# Altium project Custom Phone.PrjPcb (part 1 of 4)
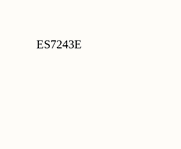
[diagram p0: CM5 + IO.SchDoc, top left]
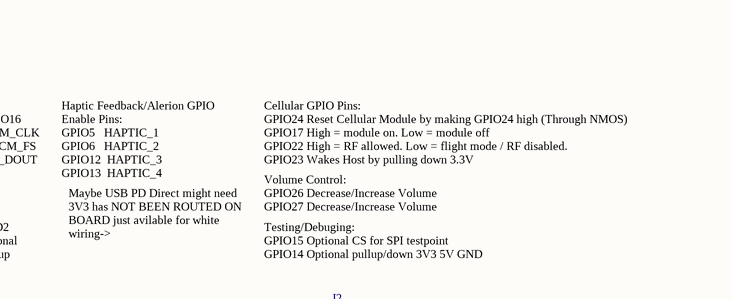
[diagram p1: CM5 + IO.SchDoc, top right]
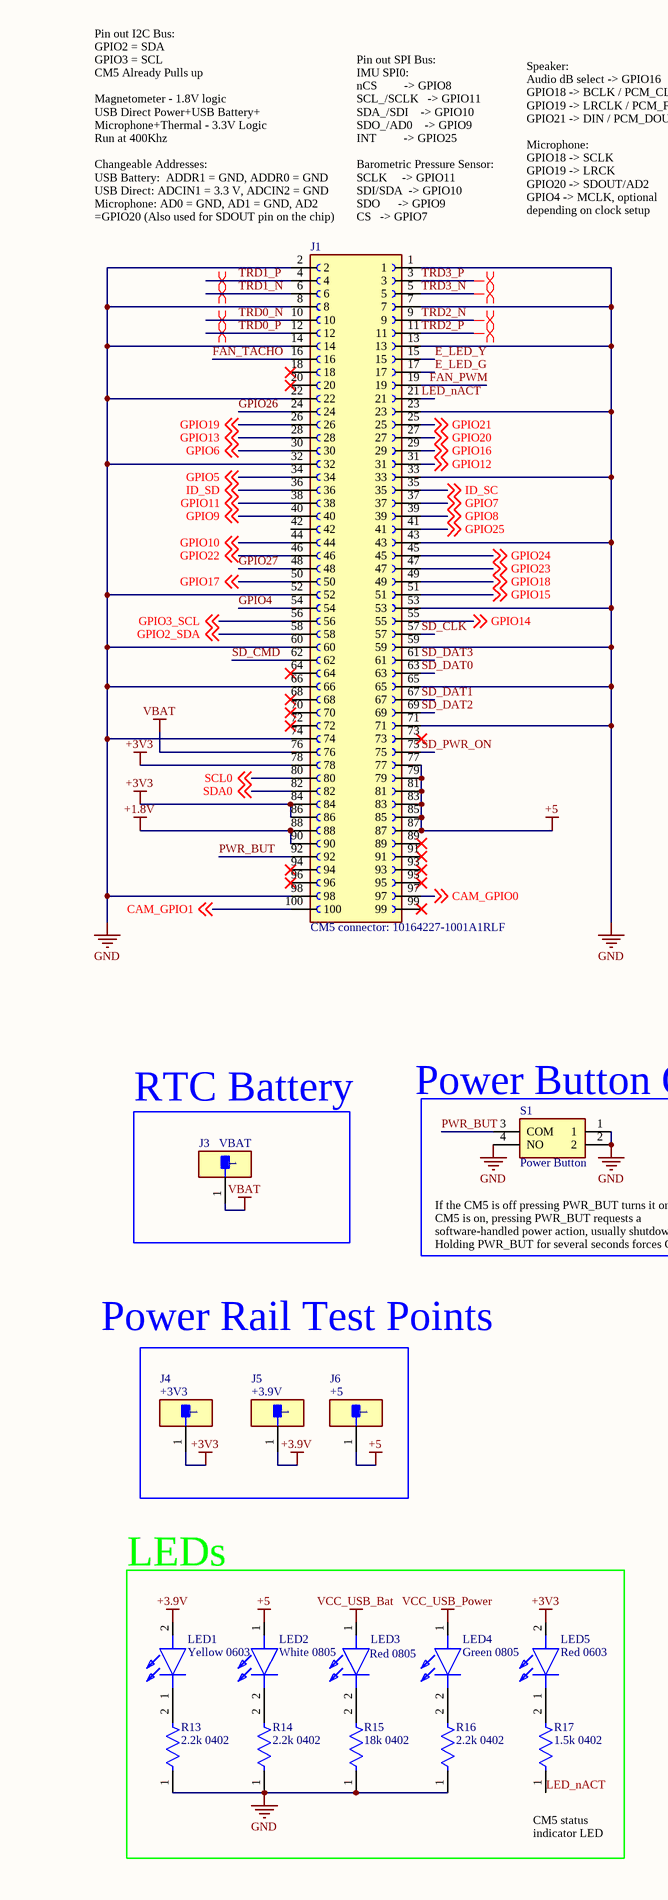
[diagram p2: CM5 + IO.SchDoc, bottom left]
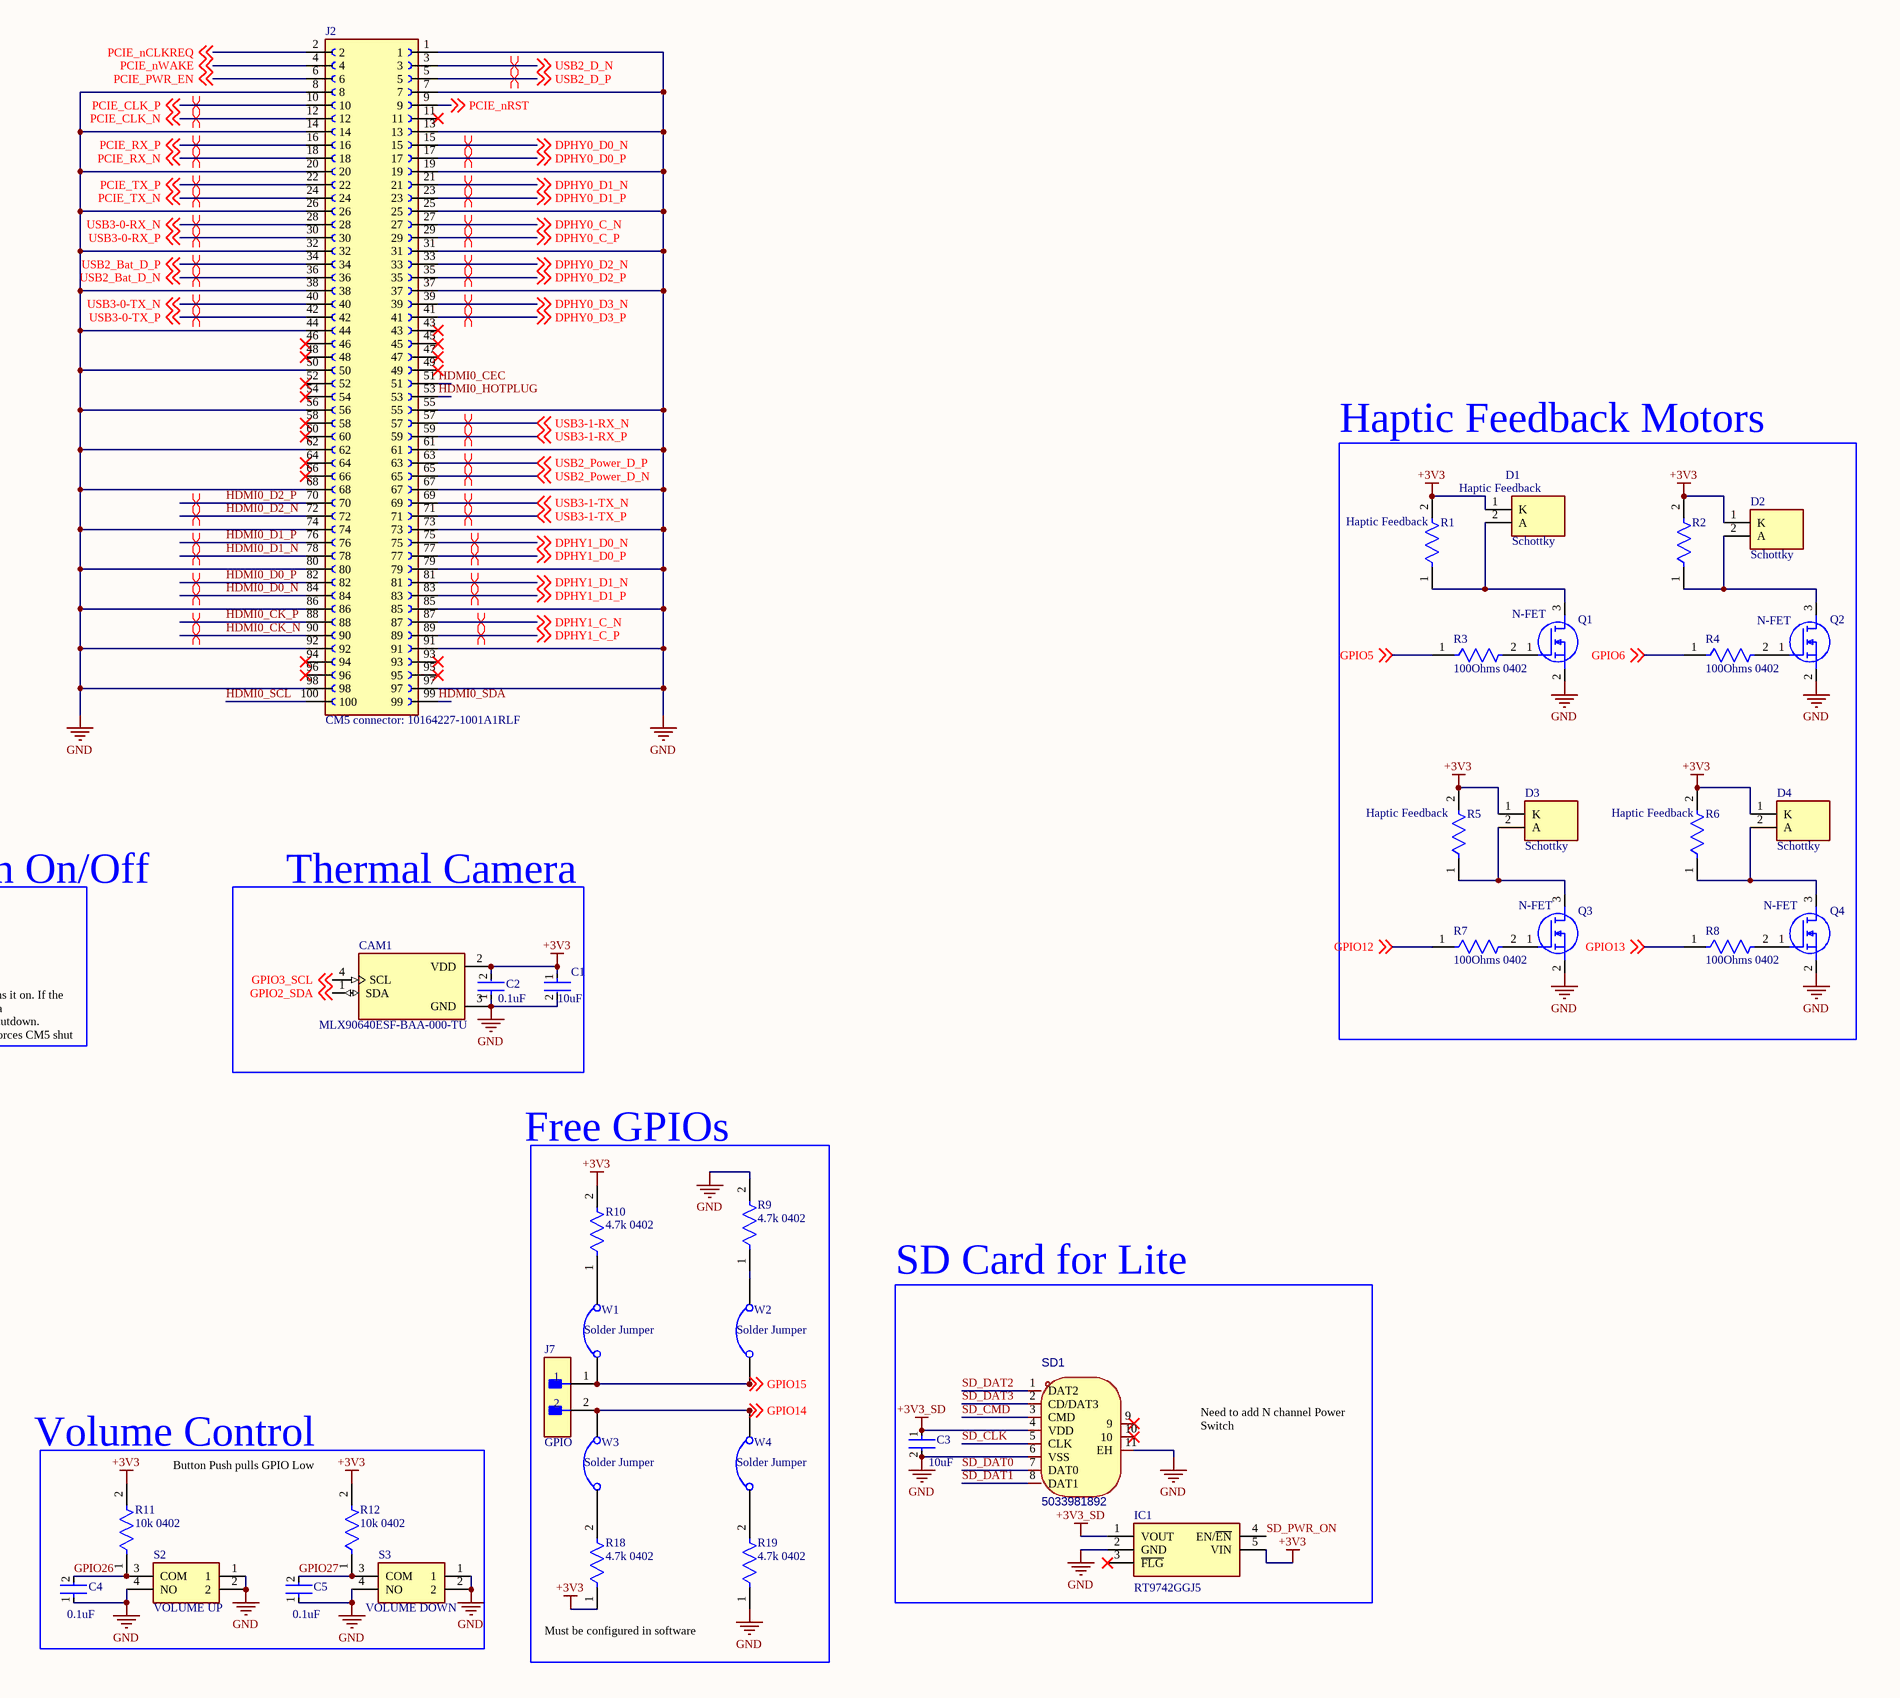
[diagram p3: CM5 + IO.SchDoc, bottom right]
9 sheets, 376 parts. Net scope: global (net labels, ports and power ports of the same name join across sheets).
Board file: Phone Full PCB.PcbDoc
Sheets:
  CM5 + IO.SchDoc
  High-Speed Interfaces.SchDoc
  Power.SchDoc
  Battery Management and Charging.SchDoc
  USBC.SchDoc
  Cellular.SchDoc
  Audio.SchDoc
  Sensors.SchDoc
  Camera + Display.SchDoc

## Sheet CM5 + IO.SchDoc
size C; SheetNumber: 1; SheetTotal: 8

### Parts
C1  10uF  [FP-CC0603-DC-MFG]
C2  0.1uF  [FP-C0402-BB-MFG]
C3  10uF  [FP-CC0603-DC-MFG]
C4  0.1uF  [FP-C0402-BB-MFG]
C5  0.1uF  [FP-C0402-BB-MFG]
CAM1  MLX90640ESF-BAA-000-TU  [TO292P930H600-4]
D1  Schottky  [SOD2513X120N]
D2  Schottky  [SOD2513X120N]
D3  Schottky  [SOD2513X120N]
D4  Schottky  [SOD2513X120N]
IC1  RT9742GGJ5  [SOT94P280X100-5N]
J1  CM5 connector: 10164227-1001A1RLF  [Correct AMPHENOL_10164227-1001A1RLF]
J2  CM5 connector: 10164227-1001A1RLF  [Correct AMPHENOL_10164227-1001A1RLF]
J3  VBAT  [FP-TSW-101-07-L-S-MFG]
J4  +3V3  [FP-5015-MFG]
J5  +3.9V  [FP-5015-MFG]
J6  +5  [FP-5015-MFG]
J7  GPIO  [FP-TSW-102-07-F-S-MFG]
LED1  Yellow 0603  [LEDC1608X70N]
LED2  White 0805  [KT0805G]
LED3  Red 0805  [KT0805G]
LED4  Green 0805  [KT0805G]
LED5  Red 0603  [LEDC1608X70N]
Q1  N-FET  [SOT95P280X125-3N]
Q2  N-FET  [SOT95P280X125-3N]
Q3  N-FET  [SOT95P280X125-3N]
Q4  N-FET  [SOT95P280X125-3N]
R1  Haptic Feedback  [FP-RMCF1206-IPC_B]
R2  Haptic Feedback  [FP-RMCF1206-IPC_B]
R3  100Ohms 0402  [FP-RMCF0402-MFG]
R4  100Ohms 0402  [FP-RMCF0402-MFG]
R5  Haptic Feedback  [FP-RMCF1206-IPC_B]
R6  Haptic Feedback  [FP-RMCF1206-IPC_B]
R7  100Ohms 0402  [FP-RMCF0402-MFG]
R8  100Ohms 0402  [FP-RMCF0402-MFG]
R9  4.7k 0402  [FP-RMCF0402-MFG]
R10  4.7k 0402  [FP-RMCF0402-MFG]
R11  10k 0402  [FP-RMCF0402-MFG]
R12  10k 0402  [FP-RMCF0402-MFG]
R13  2.2k 0402  [FP-AF0402-IPC_B]
R14  2.2k 0402  [FP-AF0402-IPC_B]
R15  18k 0402  [FP-AF0402-IPC_B]
R16  2.2k 0402  [FP-AF0402-IPC_B]
R17  1.5k 0402  [FP-AF0402-IPC_B]
R18  4.7k 0402  [FP-RMCF0402-MFG]
R19  4.7k 0402  [FP-RMCF0402-MFG]
S1  Power Button  [TS24CA]
S2  VOLUME UP  [TS24CA]
S3  VOLUME DOWN  [TS24CA]
SD1  5033981892  [TF-SMD_503398-1892]
W1  Solder Jumper  [Solder Bridge]
W2  Solder Jumper  [Solder Bridge]
W3  Solder Jumper  [Solder Bridge]
W4  Solder Jumper  [Solder Bridge]

### Blocks framed on the sheet
Haptic Feedback Motors: D1-D4 Q1-Q4 R1-R8
RTC Battery: J3
Thermal Camera: C1 C2 CAM1
SD Card for Lite: C3 IC1 SD1
LEDs: LED1-LED5 R13-R17

### Nets
+1.8V: J1.88 J1.90
+3.9V: J5.1 LED1.2(A)
+3V3: C1.1 C2.2 CAM1.2(VDD) D1.1(K) D2.1(K) D3.1(K) D4.1(K) IC1.5(VIN) J1.78 J1.84 J1.86 J4.1 LED5.2(A) R1.2 R2.2 R5.2 R6.2 R10.2 R11.2 R12.2 R18.1
+3V3_SD: C3.1 IC1.1(VOUT) SD1.4(VDD)
+5: J1.77 J1.79 J1.81 J1.83 J1.85 J1.87 J6.1 LED2.1(A)
GND: C1.2 C2.1 C3.2 C4.1 C5.1 CAM1.3(GND) IC1.2(GND) J1.1 J1.2 J1.7 J1.8 J1.13 J1.14 J1.22 J1.23 J1.32 J1.33 J1.43 J1.52 J1.53 J1.59 J1.60 J1.65 J1.66 J1.71 J1.74 J1.98 J2.1 J2.7 J2.8 J2.13 J2.14 J2.19 J2.20 J2.25 J2.26 J2.31 J2.32 J2.37 J2.38 J2.44 J2.50 J2.55 J2.56 J2.61 J2.62 J2.67 J2.68 J2.73 J2.74 J2.79 J2.80 J2.85 J2.86 J2.91 J2.92 J2.97 J2.98 Q1.2(S) Q2.2(S) Q3.2(S) Q4.2(S) R9.2 R13.1 R14.1 R15.1 R16.1 R19.1 S1.1 S1.2 S1.4(NO) S2.1 S2.2 S2.4(NO) S3.1 S3.2 S3.4(NO) SD1.6(VSS) SD1.11(EH)
VBAT: J1.76 J3.1
VCC_USB_Bat: LED3.1(A)
VCC_USB_Power: LED4.1(A)
CAM_GPIO0: J1.97 ; off-sheet CAM_GPIO0
CAM_GPIO1: J1.100 ; off-sheet CAM_GPIO1
DPHY0_C_N: J2.27 ; off-sheet DPHY0_C_N
DPHY0_C_P: J2.29 ; off-sheet DPHY0_C_P
DPHY0_D0_N: J2.15 ; off-sheet DPHY0_D0_N
DPHY0_D0_P: J2.17 ; off-sheet DPHY0_D0_P
DPHY0_D1_N: J2.21 ; off-sheet DPHY0_D1_N
DPHY0_D1_P: J2.23 ; off-sheet DPHY0_D1_P
DPHY0_D2_N: J2.33 ; off-sheet DPHY0_D2_N
DPHY0_D2_P: J2.35 ; off-sheet DPHY0_D2_P
DPHY0_D3_N: J2.39 ; off-sheet DPHY0_D3_N
DPHY0_D3_P: J2.41 ; off-sheet DPHY0_D3_P
DPHY1_C_N: J2.87 ; off-sheet DPHY1_C_N
DPHY1_C_P: J2.89 ; off-sheet DPHY1_C_P
DPHY1_D0_N: J2.75 ; off-sheet DPHY1_D0_N
DPHY1_D0_P: J2.77 ; off-sheet DPHY1_D0_P
DPHY1_D1_N: J2.81 ; off-sheet DPHY1_D1_N
DPHY1_D1_P: J2.83 ; off-sheet DPHY1_D1_P
E_LED_G: J1.17
E_LED_Y: J1.15
FAN_PWM: J1.19
FAN_TACHO: J1.16
GPIO2_SDA: CAM1.1(SDA) J1.58 ; off-sheet GPIO2_SDA
GPIO3_SCL: CAM1.4(SCL) J1.56 ; off-sheet GPIO3_SCL
GPIO4: J1.54
GPIO5: J1.34 R3.1 ; off-sheet GPIO5
GPIO6: J1.30 R4.1 ; off-sheet GPIO6
GPIO7: J1.37 ; off-sheet GPIO7
GPIO8: J1.39 ; off-sheet GPIO8
GPIO9: J1.40 ; off-sheet GPIO9
GPIO10: J1.44 ; off-sheet GPIO10
GPIO11: J1.38 ; off-sheet GPIO11
GPIO12: J1.31 R7.1 ; off-sheet GPIO12
GPIO13: J1.28 R8.1 ; off-sheet GPIO13
GPIO14: J1.55 J7.2 W3.2 W4.2 ; off-sheet GPIO14
GPIO15: J1.51 J7.1 W1.1 W2.1 ; off-sheet GPIO15
GPIO16: J1.29 ; off-sheet GPIO16
GPIO17: J1.50 ; off-sheet GPIO17
GPIO18: J1.49 ; off-sheet GPIO18
GPIO19: J1.26 ; off-sheet GPIO19
GPIO20: J1.27 ; off-sheet GPIO20
GPIO21: J1.25 ; off-sheet GPIO21
GPIO22: J1.46 ; off-sheet GPIO22
GPIO23: J1.47 ; off-sheet GPIO23
GPIO24: J1.45 ; off-sheet GPIO24
GPIO25: J1.41 ; off-sheet GPIO25
GPIO26: C4.2 J1.24 R11.1 S2.3(COM)
GPIO27: C5.2 J1.48 R12.1 S3.3(COM)
HDMI0_CEC: J2.51
HDMI0_CK_N: J2.90
HDMI0_CK_P: J2.88
HDMI0_D0_N: J2.84
HDMI0_D0_P: J2.82
HDMI0_D1_N: J2.78
HDMI0_D1_P: J2.76
HDMI0_D2_N: J2.72
HDMI0_D2_P: J2.70
HDMI0_HOTPLUG: J2.53
HDMI0_SCL: J2.100
HDMI0_SDA: J2.99
ID_SC: J1.35 ; off-sheet ID_SC
ID_SD: J1.36 ; off-sheet ID_SD
LED_nACT: J1.21 R17.1
PCIE_CLK_N: J2.12 ; off-sheet PCIE_CLK_N
PCIE_CLK_P: J2.10 ; off-sheet PCIE_CLK_P
PCIE_nCLKREQ: J2.2 ; off-sheet PCIE_nCLKREQ
PCIE_nRST: J2.9 ; off-sheet PCIE_nRST
PCIE_nWAKE: J2.4 ; off-sheet PCIE_nWAKE
PCIE_PWR_EN: J2.6 ; off-sheet PCIE_PWR_EN
PCIE_RX_N: J2.18 ; off-sheet PCIE_RX_N
PCIE_RX_P: J2.16 ; off-sheet PCIE_RX_P
PCIE_TX_N: J2.24 ; off-sheet PCIE_TX_N
PCIE_TX_P: J2.22 ; off-sheet PCIE_TX_P
PWR_BUT: J1.92 S1.3(COM)
SCL0: J1.80 ; off-sheet SCL0
SD_CLK: J1.57 SD1.5(CLK)
SD_CMD: J1.62 SD1.3(CMD)
SD_DAT0: J1.63 SD1.7(DAT0)
SD_DAT1: J1.67 SD1.8(DAT1)
SD_DAT2: J1.69 SD1.1(DAT2)
SD_DAT3: J1.61 SD1.2(CD/DAT3)
SD_PWR_ON: IC1.4(EN/~{EN}) J1.75
SDA0: J1.82 ; off-sheet SDA0
TRD0_N: J1.10
TRD0_P: J1.12
TRD1_N: J1.6
TRD1_P: J1.4
TRD2_N: J1.9
TRD2_P: J1.11
TRD3_N: J1.5
TRD3_P: J1.3
USB2_Bat_D_N: J2.36 ; off-sheet USB2_Bat_D_N
USB2_Bat_D_P: J2.34 ; off-sheet USB2_Bat_D_P
USB2_D_N: J2.3 ; off-sheet USB2_D_N
USB2_D_P: J2.5 ; off-sheet USB2_D_P
USB2_Power_D_N: J2.65 ; off-sheet USB2_Power_D_N
USB2_Power_D_P: J2.63 ; off-sheet USB2_Power_D_P
USB3-0-RX_N: J2.28 ; off-sheet USB3-0-RX_N
USB3-0-RX_P: J2.30 ; off-sheet USB3-0-RX_P
USB3-0-TX_N: J2.40 ; off-sheet USB3-0-TX_N
USB3-0-TX_P: J2.42 ; off-sheet USB3-0-TX_P
USB3-1-RX_N: J2.57 ; off-sheet USB3-1-RX_N
USB3-1-RX_P: J2.59 ; off-sheet USB3-1-RX_P
USB3-1-TX_N: J2.69 ; off-sheet USB3-1-TX_N
USB3-1-TX_P: J2.71 ; off-sheet USB3-1-TX_P
NetD1_2: D1.2(A) Q1.3(D) R1.1
NetD2_2: D2.2(A) Q2.3(D) R2.1
NetD3_2: D3.2(A) Q3.3(D) R5.1
NetD4_2: D4.2(A) Q4.3(D) R6.1
NetLED1_1: LED1.1(K) R13.2
NetLED2_2: LED2.2(K) R14.2
NetLED3_2: LED3.2(K) R15.2
NetLED4_2: LED4.2(K) R16.2
NetLED5_1: LED5.1(K) R17.2
NetQ1_1: Q1.1(G) R3.2
NetQ2_1: Q2.1(G) R4.2
NetQ3_1: Q3.1(G) R7.2
NetQ4_1: Q4.1(G) R8.2
NetR9_1: R9.1 W2.2
NetR10_1: R10.1 W1.2
NetR18_2: R18.2 W3.1
NetR19_2: R19.2 W4.1

Not connected (* = marked no-connect by the designer): IC1 3(~{FLG})*; J1 18* 20* 42 64* 68* 70* 72* 73* 89* 91* 93* 94* 95* 96* 99*; J2 11* 43* 45* 46* 47* 48* 49* 52* 54* 58* 60* 64* 66* 93* 94* 95* 96*; SD1 9* 10*

### Layout directives
differential pair: DPHY0_C_N, DPHY0_C_P, DPHY0_D0_N, DPHY0_D0_P, DPHY0_D1_N, DPHY0_D1_P, DPHY0_D2_N, DPHY0_D2_P, DPHY0_D3_N, DPHY0_D3_P, DPHY1_C_N, DPHY1_C_P, DPHY1_D0_N, DPHY1_D0_P, DPHY1_D1_N, DPHY1_D1_P, HDMI0_CK_N, HDMI0_CK_P, HDMI0_D0_N, HDMI0_D0_P, HDMI0_D1_N, HDMI0_D1_P, HDMI0_D2_N, HDMI0_D2_P, PCIE_CLK_N, PCIE_CLK_P, PCIE_RX_N, PCIE_RX_P, PCIE_TX_N, PCIE_TX_P, TRD0_N, TRD0_P, TRD1_N, TRD1_P, TRD2_N, TRD2_P, TRD3_N, TRD3_P, USB2_Bat_D_N, USB2_Bat_D_P, USB2_D_N, USB2_D_P, USB2_Power_D_N, USB2_Power_D_P, USB3-0-RX_N, USB3-0-RX_P, USB3-0-TX_N, USB3-0-TX_P, USB3-1-RX_N, USB3-1-RX_P, USB3-1-TX_N, USB3-1-TX_P

### Notes on the sheet
- ES7243E
- Haptic Feedback/Alerion GPIO Enable Pins:
  GPIO5   HAPTIC_1
  GPIO6   HAPTIC_2
  GPIO12  HAPTIC_3
  GPIO13  HAPTIC_4
- Cellular GPIO Pins:
  GPIO24 Reset Cellular Module by making GPIO24 high (Through NMOS)
  GPIO17 High = module on. Low = module off
  GPIO22 High = RF allowed. Low = flight mode / RF disabled.
  GPIO23 Wakes Host by pulling down 3.3V
- Volume Control:
  GPIO26 Decrease/Increase Volume
  GPIO27 Decrease/Increase Volume
- (near J1) Pin out I2C Bus:
  GPIO2 = SDA
  GPIO3 = SCL
  CM5 Already Pulls up
  Magnetometer - 1.8V logic
  USB Direct Power+USB Battery+ Microphone+Thermal - 3.3V Logic
  Run at 400Khz
  Changeable Addresses:
  USB Battery:  ADDR1 = GND, ADDR0 = GND
  USB Direct: ADCIN1 = 3.3 V, ADCIN2 = GND
  Microphone: AD0 = GND, AD1 = GND, AD2 =GPIO20 (Also used for SDOUT pin on the chip)
- (near J1) Pin out SPI Bus:
  IMU SPI0:
  nCS         -> GPIO8
  SCL_/SCLK   -> GPIO11
  SDA_/SDI    -> GPIO10
  SDO_/AD0    -> GPIO9
  INT         -> GPIO25
  Barometric Pressure Sensor:
  SCLK     -> GPIO11
  SDI/SDA  -> GPIO10
  SDO      -> GPIO9
  CS   -> GPIO7
- Speaker:
  Audio dB select -> GPIO16
  GPIO18 -> BCLK / PCM_CLK
  GPIO19 -> LRCLK / PCM_FS
  GPIO21 -> DIN / PCM_DOUT
  Microphone:
  GPIO18 -> SCLK
  GPIO19 -> LRCK
  GPIO20 -> SDOUT/AD2
  GPIO4 -> MCLK, optional depending on clock setup
- Maybe USB PD Direct might need 3V3 has NOT BEEN ROUTED ON BOARD just avilable for white wiring->
- Testing/Debuging:
  GPIO15 Optional CS for SPI testpoint
  GPIO14 Optional pullup/down 3V3 5V GND
- (near S1) Power Button On/Off
- If the CM5 is off pressing PWR_BUT turns it on. If the CM5 is on, pressing PWR_BUT requests a software-handled power action, usually shutdown. Holding PWR_BUT for several seconds forces CM5 shut down.
- Power Rail Test Points
- Free GPIOs
- Volume Control
- Button Push pulls GPIO Low
- Need to add N channel Power Switch
- (near R17) CM5 status indicator LED
- Must be configured in software

### Library data of the parts
C1 C3 = CMP-00621-81932632-1: C96446; Capacitance: 10µF; Voltage Rating: 16V; Dielectric: X5R; Material: Ceramic; Tolerance: 10%; NexarPartId: 81932632; Height: 1mm; Halogen Free: Halogen Free; Max Operating Temperature: 85°C; Voltage Rating (DC): 16V; Lead Free: Lead Free; RoHS: Non-Compliant; Min Operating Temperature: -55°C; Case/Package: 0603
C2 C4 C5 = CMP-03020-014070-2: C307331; Manufacturer: Kemet; Manufacturer Part Number: C0402C104M3PAC7867; Material: Ceramic; Tolerance: 0.2; Temperature Characteristic: X5R; Value: 0.10 μF; Temperature Coefficient: 15%; Voltage Rating: 25 V; Height: 0.55mm; Category: Cap; Temperature: -55°C to +125°C; Automotive: No; Package: C0402-BB; Temperature Range Low: -55°C; ComponentLink2Description: Datasheet; Device Class L3: Ceramic Capacitors; ComponentLink2URL: https://content.kemet.com/datasheets/KEM_C1002_X7R_SMD.pdf; Octopart: https://octopart.com/c0402c104m3pac7867-kemet-84304880; RoHS: TRUE; Temperature Range High: +125°C; Device Class L1: Passive Components; Capacitance: 0.10 μF; Lead Free: Yes; Ipc Land Pattern Name: CAPC10050X50; Device Class L2: Capacitors; Digikey Description: CAP CER 0.1UF 25V X5R 0402
CAM1 = MLX90640ESF-BAA-000-TU: LCSC do not place / Buy from digikey: MLX90640ESF-BAA-000-SP; MF: Melexis Technologies; SnapEDA_Link: https://www.snapeda.com/parts/MLX90640ESF-BAA-000-TU/Melexis/view-part/?ref=snap; Package: TO39_? FOV 110-4 Melexis; Value: *; MP: MLX90640ESF-BAA-000-TU; Check_prices: https://www.snapeda.com/parts/MLX90640ESF-BAA-000-TU/Melexis/view-part/?ref=eda
D1-D4 = B0520WS-7-F: C7502696; Manufacturer_Name: Lattice Semiconductor; Datasheet Link: https://www.diodes.com/assets/Datasheets/ds30235.pdf; Height: 1.2mm; Manufacturer_Part_Number: B0520WS-7-F; Mouser Part Number: N/A; Mouser Price/Stock: https://www.mouser.com/Search/Refine.aspx?Keyword=N%2FA
IC1 = RT9742GGJ5: C250547; Manufacturer_Name: RICHTEK; Datasheet Link: https://componentsearchengine.com/Datasheets/2/RT9742GGJ5.pdf; Height: 1mm; Manufacturer_Part_Number: RT9742GGJ5; Mouser Part Number: 835-RT9742GGJ5; Mouser Price/Stock: https://www.mouser.co.uk/ProductDetail/Richtek/RT9742GGJ5?qs=amGC7iS6iy%2FZU2tAnLZxIA%3D%3D
J1 J2 = CM5 connector: 10164227-1001A1RLF: C597931; MF: Amphenol; MP: 101642271001A1RLF; SnapEDA_Link: https://www.snapeda.com/parts/101642271001A1RLF/Amphenol/view-part/?ref=snap; Package: None; Value: *; Check_prices: https://www.snapeda.com/parts/101642271001A1RLF/Amphenol/view-part/?ref=eda
J3 = CMP-02766-001775-1: CONN HEADER VERT 1POS; Gender: Male; Number of Contacts: 1; Max Current Rating: 7.6A; Max Voltage Rating (AC): 550V; RoHS Compliant: Yes; Contact Finish - Mating: GOLD; Length: 2.54mm; Series: TSW; Insulation Material: PBT; Reach SVHC Compliant: Yes; Radiation Hardening: No; Contact Plating: Gold; Termination: Solder; Contact Type: Male Pin; Orientation: Straight; Number of Rows: 1; Depth: 2.54mm; Housing Material: Polyester; Lead Free: Lead Free; Fastening Type: Pull; Flammability Rating: UL94 V-0; Mount: Through Hole; Housing Color: Black; Contact Shape: Square; Min Operating Temperature: -55°C; Connector Type: Header; Contact Mating Length: 0.23inch; Width: 2.54mm; Packaging: Bulk; Contact Material: Bronze; Max Operating Temperature: 125°C; Number of Positions: 1; Color: Black; Insulation Color: Black
J4-J6 = CMP-2000-05183-2: PC TEST POINT MINIATURE; Manufacturer Part Number: 5015; Manufacturer: keystone; Number Of Contacts: 1; Conn Orientation: Straight; Category: Conn; Digikey Description: PC TEST POINT MINIATURE; Automotive: No; Lead Free: Yes; Octopart: https://octopart.com/5015-keystone-3822; ComponentLink2URL: http://www.keyelco.com/product-pdf.cfm?p=1353; Package: 5015; RoHS: TRUE; Device Class L3: unset; Device Class L2: unset; Contact Material: Silver; Device Class L1: Connectors; Height: 1.65mm; ComponentLink2Description: Datasheet
J7 = CMP-02766-001458-1: CONN HEADER VERT 2POS 2.54MM; Gender: Male; Max Current Rating: 7.6A; Number of Contacts: 2; Max Voltage Rating (AC): 550V; Orientation: Straight; Depth: 2.54mm; Series: TSW; Package Quantity: 1; Min Operating Temperature: -55°C; Max Operating Temperature: 125°C; Contact Type: Male Pin; Contact Shape: Square; Color: Black; Housing Color: Black; Connector Type: Header; Fastening Type: Pull; Radiation Hardening: No; Pitch: 2.54mm; Housing Material: Polyester; Mount: Through Hole; Number of Positions: 2; Number of Rows: 1; Contact Material: Bronze; Insulation Color: Black; Contact Finish - Mating: GOLD; Termination: Solder; Insulation Material: PBT; Length: 5.08mm; Flammability Rating: UL94 V-0; Contact Mating Length: 0.23inch; REACH SVHC: No SVHC; Contact Plating: Gold; RoHS Compliant: Yes; Packaging: Bulk
LED1 = KT-0603R: C89811; Manufacturer_Name: Hubei KENTO Elec; Datasheet Link: https://datasheet.lcsc.com/szlcsc/Hubei-KENTO-Elec-KT-0603R_C2286.pdf; Height: 0.7mm; Manufacturer_Part_Number: KT-0603R; LCSC: C2286
LED2 = KT-0805G: C34499; Manufacturer_Name: Hubei KENTO Elec; Datasheet Link: https://jlcpcb.com/api/file/downloadByFileSystemAccessId/8639582106239348736; Height: 0.95mm; Manufacturer_Part_Number: KT-0805G
LED3 = KT-0805G: C84256; Manufacturer_Name: Hubei KENTO Elec; Datasheet Link: https://jlcpcb.com/api/file/downloadByFileSystemAccessId/8639582106239348736; Height: 0.95mm; Manufacturer_Part_Number: KT-0805G
LED4 = KT-0805G: C2297; Manufacturer_Name: Hubei KENTO Elec; Datasheet Link: https://jlcpcb.com/api/file/downloadByFileSystemAccessId/8639582106239348736; Height: 0.95mm; Manufacturer_Part_Number: KT-0805G
LED5 = KT-0603R: C2286; Manufacturer_Name: Hubei KENTO Elec; Datasheet Link: https://datasheet.lcsc.com/szlcsc/Hubei-KENTO-Elec-KT-0603R_C2286.pdf; Height: 0.7mm; Manufacturer_Part_Number: KT-0603R; LCSC: C2286
Q1-Q4 = AO3400A: C20917; Manufacturer_Name: Alpha & Omega Semiconductors; Datasheet Link: http://aosmd.com/res/data_sheets/AO3400A.pdf; Height: 1.25mm; Manufacturer_Part_Number: AO3400A; Arrow Part Number: AO3400A; Arrow Price/Stock: https://www.arrow.com/en/products/ao3400a/alpha-and-omega-semiconductor?utm_currency=USD&region=nac
R1 R2 R5 R6 = CMP-26527-003698-1: DNP; Tolerance: 5%; Max Power Dissipation: 250mW; Temperature Coefficient: 200ppm/°C; Resistance: 6.8MR; Packaging: Tape and Reel; Case Code (Imperial): 1206; Width: 0.063inch; Height: 0.028inch; Radiation Hardening: No; Contact Plating: Tin; Series: RMCF; Length: 0.126inch; Resistor Type: Thick Film; Number of Terminations: 2; Mount: Surface Mount; Case Code (Metric): 3216; Features: Automotive AEC-Q200; Case/Package: 1206; RoHS Compliant: Yes; Min Operating Temperature: -55°C; Max Operating Temperature: 155°C
R3 R4 R7 R8 = CMP-26527-002093-1: C25076; Max Power Dissipation: 63mW; Tolerance: 5%; Resistance: 3.9R; Temperature Coefficient: 200ppm/°C; Case/Package: 0402; Number of Terminations: 2; Min Operating Temperature: -55°C; Height: 0.016inch; Packaging: Tape and Reel; Resistor Type: Thick Film; Length: 0.039inch; Mount: Surface Mount; Series: RMCF; Max Operating Temperature: 155°C; Contact Plating: Tin; Features: Automotive AEC-Q200; Width: 0.02inch; Radiation Hardening: No; RoHS Compliant: Yes
R9 R10 R18 R19 = CMP-26527-002093-1: C25900; Max Power Dissipation: 63mW; Tolerance: 5%; Resistance: 3.9R; Temperature Coefficient: 200ppm/°C; Case/Package: 0402; Number of Terminations: 2; Min Operating Temperature: -55°C; Height: 0.016inch; Packaging: Tape and Reel; Resistor Type: Thick Film; Length: 0.039inch; Mount: Surface Mount; Series: RMCF; Max Operating Temperature: 155°C; Contact Plating: Tin; Features: Automotive AEC-Q200; Width: 0.02inch; Radiation Hardening: No; RoHS Compliant: Yes
R11 R12 = CMP-26527-002093-1: C25744; Max Power Dissipation: 63mW; Tolerance: 5%; Resistance: 3.9R; Temperature Coefficient: 200ppm/°C; Case/Package: 0402; Number of Terminations: 2; Min Operating Temperature: -55°C; Height: 0.016inch; Packaging: Tape and Reel; Resistor Type: Thick Film; Length: 0.039inch; Mount: Surface Mount; Series: RMCF; Max Operating Temperature: 155°C; Contact Plating: Tin; Features: Automotive AEC-Q200; Width: 0.02inch; Radiation Hardening: No; RoHS Compliant: Yes
R13 R14 R16 = CMP-03412-049911-1: C25879; Resistance: 4.3kR; Max Power Dissipation: 63mW; Temperature Coefficient: 100ppm/°C; Tolerance: 5%; Case/Package: 0402; Height: 0.015inch; Width: 0.02inch; Min Operating Temperature: -55°C; Packaging: Tape and Reel; Max Operating Temperature: 155°C; Features: Moisture Resistant; Series: AF; Number of Terminations: 2; Length: 0.039inch; Resistor Type: Thick Film; RoHS Compliant: Yes
R15 = CMP-03412-049911-1: C25762; Resistance: 4.3kR; Max Power Dissipation: 63mW; Temperature Coefficient: 100ppm/°C; Tolerance: 5%; Case/Package: 0402; Height: 0.015inch; Width: 0.02inch; Min Operating Temperature: -55°C; Packaging: Tape and Reel; Max Operating Temperature: 155°C; Features: Moisture Resistant; Series: AF; Number of Terminations: 2; Length: 0.039inch; Resistor Type: Thick Film; RoHS Compliant: Yes
R17 = CMP-03412-049911-1: C25867; Resistance: 4.3kR; Max Power Dissipation: 63mW; Temperature Coefficient: 100ppm/°C; Tolerance: 5%; Case/Package: 0402; Height: 0.015inch; Width: 0.02inch; Min Operating Temperature: -55°C; Packaging: Tape and Reel; Max Operating Temperature: 155°C; Features: Moisture Resistant; Series: AF; Number of Terminations: 2; Length: 0.039inch; Resistor Type: Thick Film; RoHS Compliant: Yes
S1-S3 = TS24CA: C393942; Manufacturer_Name: Shou Han; Datasheet Link: https://datasheet.lcsc.com/lcsc/1912111437_SHOU-HAN-TS24CA_C393942.pdf; Height: 1.8mm; Manufacturer_Part_Number: TS24CA
SD1 = SD Card: C5362198; Manufacturer: MOLEX; Symbol: 503398-1892; Add into BOM: yes; Card Connection Mode: Push-Push; Card Type: MicroSD Card (TF Card); Connector Type: Connector and Ejector; Device: 5033981892; LCSC Part Name: 自弹式 MicroSD卡(TF卡) 卡座; Supplier Part: C428492; Manufacturer Part: 5033981892; Supplier Footprint: SMD; JLCPCB Part Class: Extended Part; Datasheet: https://www.molex.com/content/dam/molex/molex-dot-com/products/automated/en-us/salesdrawingpdf/503/503398/5033981892_sd.pdf?inline\; Supplier: LCSC; Convert to PCB: yes; Additional Card Detection Pins: -; Supplementary Features: -; Height Above Board: 1.28mm; Operating Temperature: -25℃~+85℃
W1-W4 = Solder Jumper: DNP; MF: Keystone Electronics; MP: 5102; SnapEDA_Link: https://www.snapeda.com/parts/5102/Keystone/view-part/?ref=snap; Package: NON STANDARD-2 Keystone; Value: *; Check_prices: https://www.snapeda.com/parts/5102/Keystone/view-part/?ref=eda

## Sheet High-Speed Interfaces.SchDoc
size B; SheetNumber: 2; SheetTotal: 8
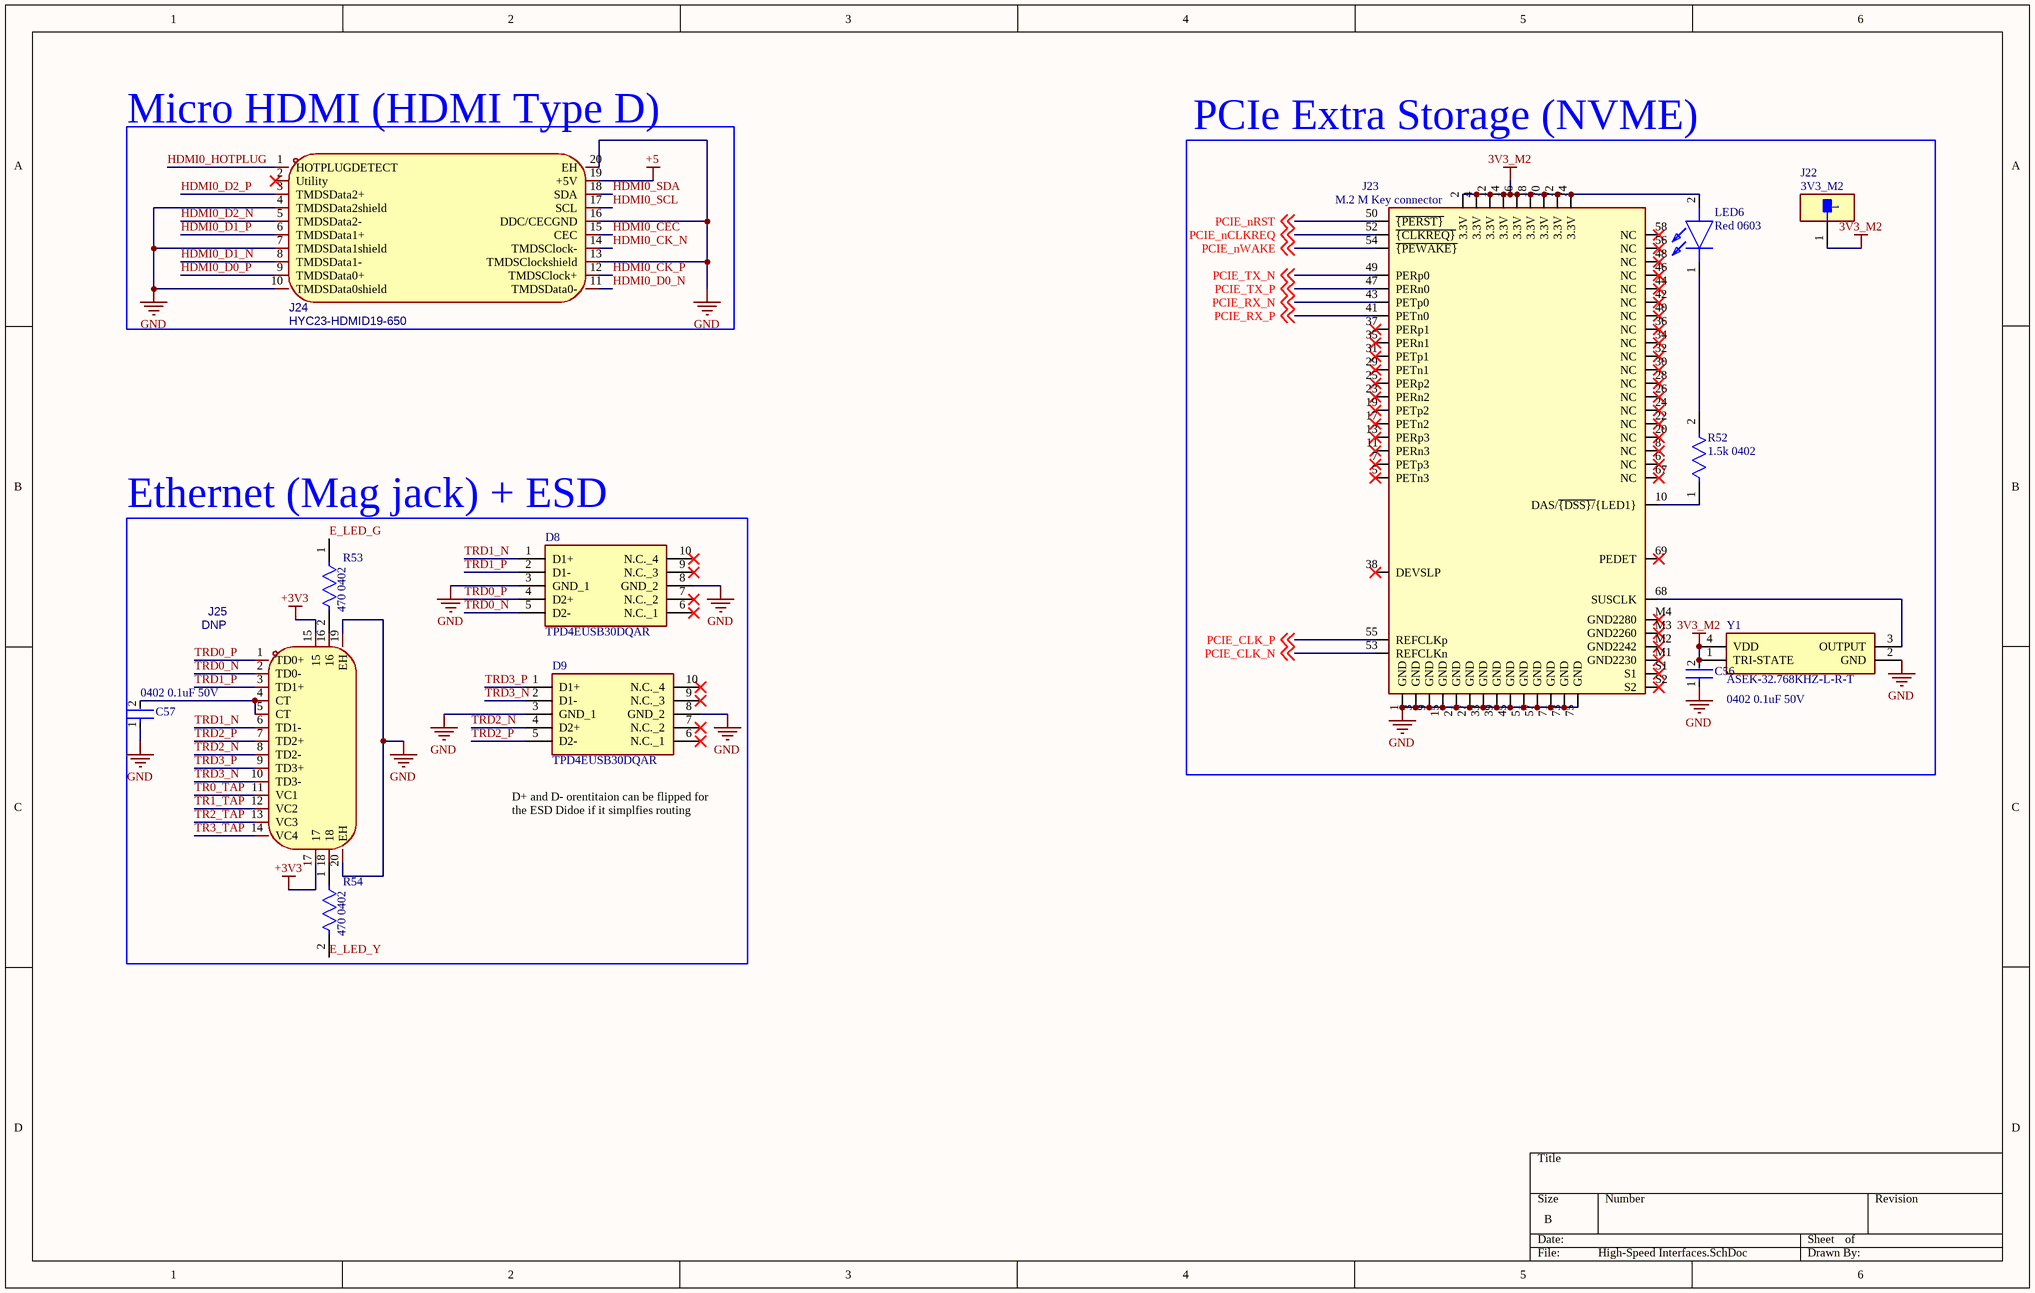
[diagram p4: High-Speed Interfaces.SchDoc]

### Parts
C56  0402 0.1uF 50V  [FP-C0402-BB-MFG]
C57  0402 0.1uF 50V  [FP-C0402-BB-MFG]
D8  TPD4EUSB30DQAR  [DQA(R-PUSON-N10)]
D9  TPD4EUSB30DQAR  [DQA(R-PUSON-N10)]
J22  3V3_M2  [FP-5015-MFG]
J23  M.2 M Key connector  [M.2 M Key connector RPI]
J24  HYC23-HDMID19-650  [AUDIO-TH_HYC23-HDMID19-650]
J25  DNP  [RJ45-TH_LPJG0926HENL_C22457393]
LED6  Red 0603  [LEDC1608X70N]
R52  1.5k 0402  [FP-AF0402-IPC_B]
R53  470 0402  [FP-RMCF0402-MFG]
R54  470 0402  [FP-RMCF0402-MFG]
Y1  ASEK-32.768KHZ-L-R-T  [ASEK32768KHZLRT]

### Blocks framed on the sheet
Micro HDMI (HDMI Type D): J24
PCIe Extra Storage (NVME): C56 J22 J23 LED6 R52 Y1
Ethernet (Mag jack) + ESD: C57 D8 D9 J25 R53 R54

### Nets
3V3_M2: C56.2 J22.1 J23.2(3.3V) J23.4(3.3V) J23.12(3.3V) J23.14(3.3V) J23.16(3.3V) J23.18(3.3V) J23.70(3.3V) J23.72(3.3V) J23.74(3.3V) LED6.2(A) Y1.1(TRI-STATE) Y1.4(VDD)
+3V3: J25.15 J25.17
+5: J24.19(+5V)
GND: C56.1 C57.1 D8.3(GND_1) D8.8(GND_2) D9.3(GND_1) D9.8(GND_2) J23.1(GND) J23.3(GND) J23.9(GND) J23.15(GND) J23.21(GND) J23.27(GND) J23.33(GND) J23.39(GND) J23.45(GND) J23.51(GND) J23.57(GND) J23.71(GND) J23.73(GND) J23.75(GND) J24.4(TMDSData2shield) J24.7(TMDSData1shield) J24.10(TMDSData0shield) J24.13(TMDSClockshield) J24.16(DDC/CECGND) J24.20(EH) J25.19(EH) J25.20(EH) Y1.2(GND)
E_LED_G: R53.1
E_LED_Y: R54.2
HDMI0_CEC: J24.15(CEC)
HDMI0_CK_N: J24.14(TMDSClock-)
HDMI0_CK_P: J24.12(TMDSClock+)
HDMI0_D0_N: J24.11(TMDSData0-)
HDMI0_D0_P: J24.9(TMDSData0+)
HDMI0_D1_N: J24.8(TMDSData1-)
HDMI0_D1_P: J24.6(TMDSData1+)
HDMI0_D2_N: J24.5(TMDSData2-)
HDMI0_D2_P: J24.3(TMDSData2+)
HDMI0_HOTPLUG: J24.1(HOTPLUGDETECT)
HDMI0_SCL: J24.17(SCL)
HDMI0_SDA: J24.18(SDA)
PCIE_CLK_N: J23.53(REFCLKn) ; off-sheet PCIE_CLK_N
PCIE_CLK_P: J23.55(REFCLKp) ; off-sheet PCIE_CLK_P
PCIE_nCLKREQ: J23.52(~{{CLKREQ}}) ; off-sheet PCIE_nCLKREQ
PCIE_nRST: J23.50(~{{PERST}}) ; off-sheet PCIE_nRST
PCIE_nWAKE: J23.54(~{{PEWAKE}}) ; off-sheet PCIE_nWAKE
PCIE_RX_N: J23.43(PETp0) ; off-sheet PCIE_RX_N
PCIE_RX_P: J23.41(PETn0) ; off-sheet PCIE_RX_P
PCIE_TX_N: J23.49(PERp0) ; off-sheet PCIE_TX_N
PCIE_TX_P: J23.47(PERn0) ; off-sheet PCIE_TX_P
TR0_TAP: J25.11(VC1)
TR1_TAP: J25.12(VC2)
TR2_TAP: J25.13(VC3)
TR3_TAP: J25.14(VC4)
TRD0_N: D8.5(D2-) J25.2(TD0-)
TRD0_P: D8.4(D2+) J25.1(TD0+)
TRD1_N: D8.1(D1+) J25.6(TD1-)
TRD1_P: D8.2(D1-) J25.3(TD1+)
TRD2_N: D9.4(D2+) J25.8(TD2-)
TRD2_P: D9.5(D2-) J25.7(TD2+)
TRD3_N: D9.2(D1-) J25.10(TD3-)
TRD3_P: D9.1(D1+) J25.9(TD3+)
NetC57_2: C57.2 J25.4(CT) J25.5(CT)
NetJ23_10: J23.10(DAS/~{{DSS}/}{LED1}) R52.1
NetJ23_68: J23.68(SUSCLK) Y1.3(OUTPUT)
NetJ25_16: J25.16 R53.2
NetJ25_18: J25.18 R54.1
NetLED6_1: LED6.1(K) R52.2

Not connected (* = marked no-connect by the designer): D8 6(N.C._1)* 7(N.C._2)* 9(N.C._3)* 10(N.C._4)*; D9 6(N.C._1)* 7(N.C._2)* 9(N.C._3)* 10(N.C._4)*; J23 5(PETn3)* 6(NC)* 7(PETp3)* 8(NC)* 11(PERn3)* 13(PERp3)* 17(PETn2)* 19(PETp2)* 20(NC)* 22(NC)* 23(PERn2)* 24(NC)* 25(PERp2)* 26(NC)* 28(NC)* 29(PETn1)* 30(NC)* 31(PETp1)* 32(NC)* 34(NC)* 35(PERn1)* 36(NC)* 37(PERp1)* 38(DEVSLP)* 40(NC)* 42(NC)* 44(NC)* 46(NC)* 48(NC)* 56(NC)* 58(NC)* 67(NC)* 69(PEDET)* M1(GND2230)* M2(GND2242)* M3(GND2260)* M4(GND2280)* S1* S2*; J24 2(Utility)*

### Notes on the sheet
- (near D9) D+ and D- orentitaion can be flipped for the ESD Didoe if it simplfies routing

### Library data of the parts
C56 C57 = CMP-03020-014070-2: as C2 on sheet CM5 + IO; Height: 0.55mm; Category: Cap; Temperature: -55°C to +125°C; Automotive: No; Package: C0402-BB; Temperature Range Low: -55°C; ComponentLink2Description: Datasheet; Device Class L3: Ceramic Capacitors; ComponentLink2URL: https://content.kemet.com/datasheets/KEM_C1002_X7R_SMD.pdf; Octopart: https://octopart.com/c0402c104m3pac7867-kemet-84304880; RoHS: TRUE; Temperature Range High: +125°C; Device Class L1: Passive Components; Capacitance: 0.10 μF; Lead Free: Yes; Ipc Land Pattern Name: CAPC10050X50; Device Class L2: Capacitors; Digikey Description: CAP CER 0.1UF 25V X5R 0402
D8 D9 = TPD4EUSB30DQAR: C90627; Manufacturer_Name: Texas Instruments; Datasheet Link: http://www.ti.com/lit/gpn/tpd4eusb30; Manufacturer_Part_Number: TPD4EUSB30DQAR; Mouser Part Number: 595-TPD4EUSB30DQAR; Mouser Price/Stock: https://www.mouser.co.uk/ProductDetail/Texas-Instruments/TPD4EUSB30DQAR?qs=Ze4%2FuFuz19JpY4uqYOLMbQ%3D%3D; Arrow Part Number: TPD4EUSB30DQAR; Arrow Price/Stock: https://www.arrow.com/en/products/tpd4eusb30dqar/texas-instruments.html?utm_currency=USD&region=nac
J22 = CMP-2000-05183-2: as J4 on sheet CM5 + IO; Category: Conn; Digikey Description: PC TEST POINT MINIATURE; Automotive: No; Lead Free: Yes; Octopart: https://octopart.com/5015-keystone-3822; ComponentLink2URL: http://www.keyelco.com/product-pdf.cfm?p=1353; Package: 5015; RoHS: TRUE; Device Class L3: unset; Device Class L2: unset; Contact Material: Silver; Device Class L1: Connectors; Height: 1.65mm; ComponentLink2Description: Datasheet
J23 = M.2 M Key connector RPI: C841661; Gender: Female; Number of Positions: 67; Contact Current Rating: 500mA; Pitch: 0.5mm; SM P/N: 13806721; PCB Mounting Orientation: Right Angle; Termination: Solder; Insulation Material: Thermoplastic; Number of Rows: 2; Housing Color: Black; Min Operating Temperature: -40°C; ELV: Compliant; Height: 0.165inch; Orientation: Right Angle; Contact Plating: Gold,Matte; Mount: Surface Mount; Length: 0.862inch; Width: 8.7mm; RoHS Compliant: Yes; Housing Material: Thermoplastic; Packaging: Tape and Reel; Color: Black; Contact Material: Copper Alloy; Max Operating Temperature: 80°C
J24 = HDMI: C711358; Manufacturer: 华宇创; Add into BOM: yes; Connector Type: HDMI-D; Gender: Female; Current Rating: 300mA; Symbol: HYC23-HDMID19-650; Device: HYC23-HDMID19-650; LCSC Part Name: HDMI-D 母 19P; Supplier Part: C711358; Manufacturer Part: HYC23-HDMID19-650; Supplier Footprint: SMD; JLCPCB Part Class: Extended Part; Datasheet: https://item.szlcsc.com/datasheet/HYC23-HDMID19-650/750253.html; Supplier: LCSC; Convert to PCB: yes; Number of Pins: 19P; Mounting Type: Surface Mount, Right Angle; Voltage Rating: -; Operating Temperature: -40℃~+85℃
J25 = Ethernet Correct: C22457393; Manufacturer: LINK-PP(连普科技); Manufacturer Part: LPJG0926HENL; Symbol: LPJG0926HENL_C22457393; Add into BOM: yes; Connector Type: RJ45 Jack; Number of Ports: 1; LED: With LED; Shielding: Shielded; PoE: Non-PoE; Device: LPJG0926HENL_C22457393; LCSC Part Name: 弯插 带LED; Supplier Part: C22457393; Supplier Footprint: 插件; JLCPCB Part Class: Extended Part; Datasheet: https://item.szlcsc.com/datasheet/LPJG0926HENL/24125913.html; Supplier: LCSC; Convert to PCB: yes; Mounting Type: Right Angle; Contact Material: Phosphor Bronze; Contact Plating: Gold; Operating Temperature: 0℃~+70℃
LED6 = KT-0603R: as LED5 on sheet CM5 + IO; Datasheet Link: https://datasheet.lcsc.com/szlcsc/Hubei-KENTO-Elec-KT-0603R_C2286.pdf; Height: 0.7mm; Manufacturer_Part_Number: KT-0603R; LCSC: C2286
R52 = CMP-03412-049911-1: as R17 on sheet CM5 + IO; Case/Package: 0402; Height: 0.015inch; Width: 0.02inch; Min Operating Temperature: -55°C; Packaging: Tape and Reel; Max Operating Temperature: 155°C; Features: Moisture Resistant; Series: AF; Number of Terminations: 2; Length: 0.039inch; Resistor Type: Thick Film; RoHS Compliant: Yes
R53 R54 = CMP-26527-002093-1: C25117; Max Power Dissipation: 63mW; Tolerance: 5%; Resistance: 3.9R; Temperature Coefficient: 200ppm/°C; Case/Package: 0402; Number of Terminations: 2; Min Operating Temperature: -55°C; Height: 0.016inch; Packaging: Tape and Reel; Resistor Type: Thick Film; Length: 0.039inch; Mount: Surface Mount; Series: RMCF; Max Operating Temperature: 155°C; Contact Plating: Tin; Features: Automotive AEC-Q200; Width: 0.02inch; Radiation Hardening: No; RoHS Compliant: Yes
Y1 = ASEK-32.768KHZ-L-R-T: C2650753; Manufacturer_Name: ABRACON; Datasheet Link: https://abracon.com/Oscillators/ASEK.pdf; Height: 1.2mm; Manufacturer_Part_Number: ASEK-32.768KHZ-L-R-T